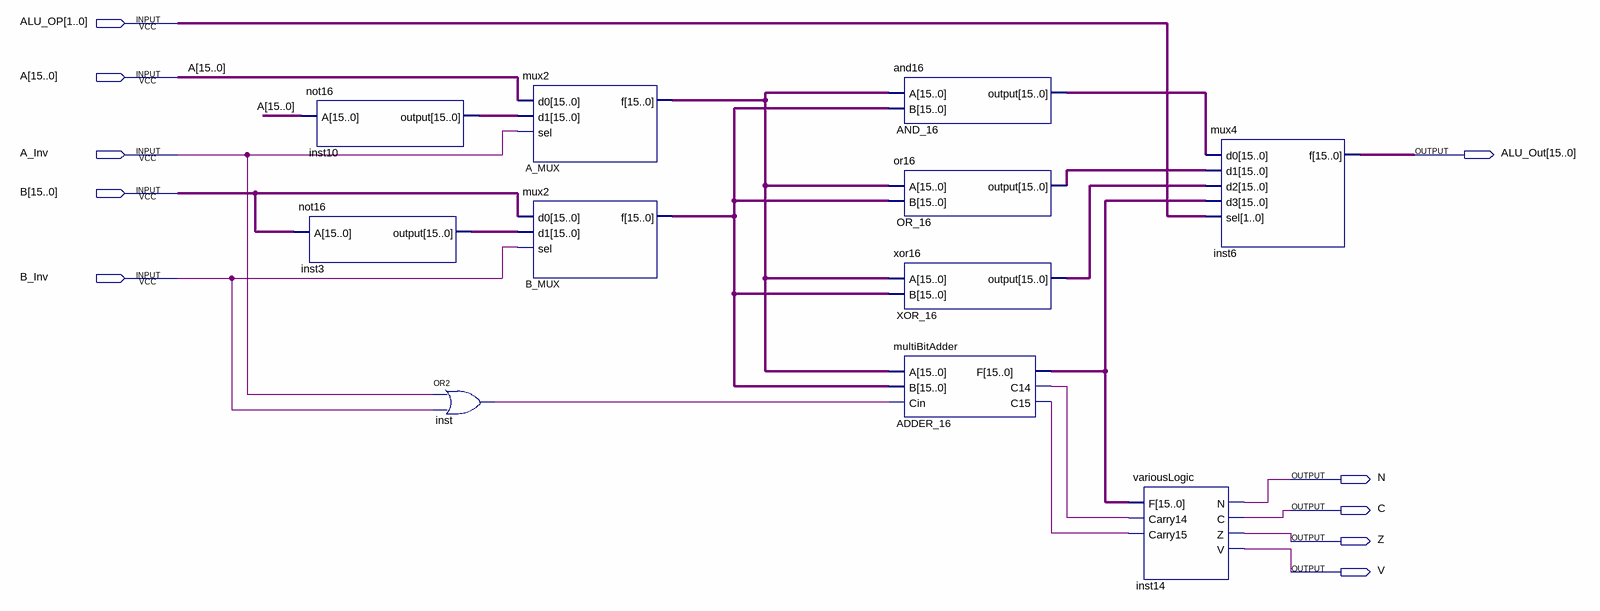
[diagram p0: schematic sheet]
// Quartus schematic alu.bdf as structural Verilog: 11 symbols, 10 pins
module alu (
  input  [1:0] ALU_OP,
  input  [15:0] A,
  input  A_Inv,
  input  [15:0] B,
  input  B_Inv,
  output [15:0] ALU_Out,
  output N,
  output C,
  output Z,
  output V
);

  wire ADDER_16_c14, ADDER_16_c15, inst_out;
  wire [15:0] A_MUX_f, ADDER_16_f, AND_16_output, B_MUX_f, inst3_output, inst10_output, OR_16_output,
       XOR_16_output;

  not16 inst10 (.A(A), .\output (inst10_output));
  not16 inst3 (.A(B), .\output (inst3_output));
  or inst (inst_out, A_Inv, B_Inv);
  mux2 A_MUX (.d0(A), .d1(inst10_output), .sel(A_Inv), .f(A_MUX_f));
  mux2 B_MUX (.d0(B), .d1(inst3_output), .sel(B_Inv), .f(B_MUX_f));
  and16 AND_16 (.A(A_MUX_f), .B(B_MUX_f), .\output (AND_16_output));
  or16 OR_16 (.A(A_MUX_f), .B(B_MUX_f), .\output (OR_16_output));
  xor16 XOR_16 (.A(A_MUX_f), .B(B_MUX_f), .\output (XOR_16_output));
  multiBitAdder ADDER_16 (
    .A(A_MUX_f), .B(B_MUX_f), .Cin(inst_out), .F(ADDER_16_f), .C14(ADDER_16_c14), .C15(ADDER_16_c15));
  variousLogic inst14 (.F(ADDER_16_f), .Carry14(ADDER_16_c14), .Carry15(ADDER_16_c15), .N(N), .C(C), .Z(Z), .V(V));
  mux4 inst6 (.d0(AND_16_output), .d1(OR_16_output), .d2(XOR_16_output), .d3(ADDER_16_f), .sel(ALU_OP), .f(ALU_Out));
endmodule
